# Altium project Main.PrjPCB
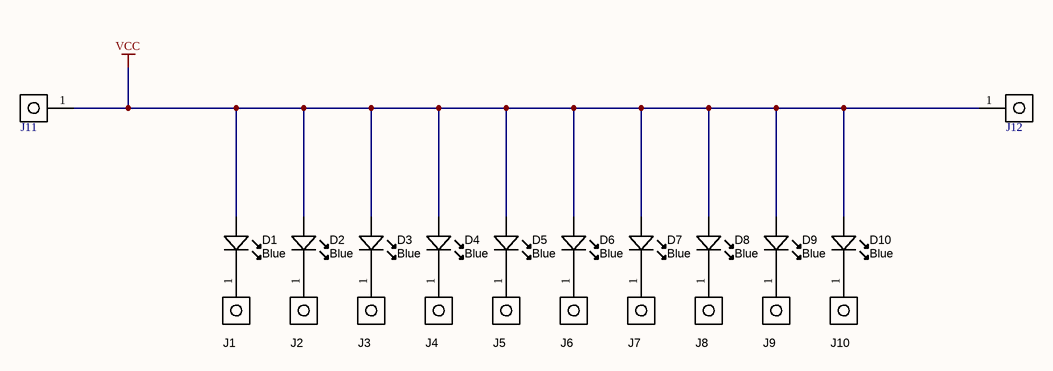
[diagram p0: LEDs.SchDoc]
1 sheet, 22 parts. Net scope: global (net labels, ports and power ports of the same name join across sheets).
Board file: PCB.PcbDoc

## Sheet LEDs.SchDoc
size A4

### Parts
D1  Blue  [LED-0805S-SIDELED-2.1X0.6X1.0]
D2  Blue  [LED-0805S-SIDELED-2.1X0.6X1.0]
D3  Blue  [LED-0805S-SIDELED-2.1X0.6X1.0]
D4  Blue  [LED-0805S-SIDELED-2.1X0.6X1.0]
D5  Blue  [LED-0805S-SIDELED-2.1X0.6X1.0]
D6  Blue  [LED-0805S-SIDELED-2.1X0.6X1.0]
D7  Blue  [LED-0805S-SIDELED-2.1X0.6X1.0]
D8  Blue  [LED-0805S-SIDELED-2.1X0.6X1.0]
D9  Blue  [LED-0805S-SIDELED-2.1X0.6X1.0]
D10  Blue  [LED-0805S-SIDELED-2.1X0.6X1.0]
J1  CONN_SOCKET_1x1P_0.100in  [1x1POS_SOCKET_LOWPROF]  (value not drawn)
J2  CONN_SOCKET_1x1P_0.100in  [1x1POS_SOCKET_LOWPROF]  (value not drawn)
J3  CONN_SOCKET_1x1P_0.100in  [1x1POS_SOCKET_LOWPROF]  (value not drawn)
J4  CONN_SOCKET_1x1P_0.100in  [1x1POS_SOCKET_LOWPROF]  (value not drawn)
J5  CONN_SOCKET_1x1P_0.100in  [1x1POS_SOCKET_LOWPROF]  (value not drawn)
J6  CONN_SOCKET_1x1P_0.100in  [1x1POS_SOCKET_LOWPROF]  (value not drawn)
J7  CONN_SOCKET_1x1P_0.100in  [1x1POS_SOCKET_LOWPROF]  (value not drawn)
J8  CONN_SOCKET_1x1P_0.100in  [1x1POS_SOCKET_LOWPROF]  (value not drawn)
J9  CONN_SOCKET_1x1P_0.100in  [1x1POS_SOCKET_LOWPROF]  (value not drawn)
J10  CONN_SOCKET_1x1P_0.100in  [1x1POS_SOCKET_LOWPROF]  (value not drawn)
J11  CONN_SOCKET_1x1P_0.100in  [1x1POS_SOCKET_LOWPROF]  (value not drawn)
J12  CONN_SOCKET_1x1P_0.100in  [1x1POS_SOCKET_LOWPROF]  (value not drawn)

### Nets
VCC: D1.A D2.A D3.A D4.A D5.A D6.A D7.A D8.A D9.A D10.A J11.1 J12.1
NetD1_K: D1.K J1.1
NetD2_K: D2.K J2.1
NetD3_K: D3.K J3.1
NetD4_K: D4.K J4.1
NetD5_K: D5.K J5.1
NetD6_K: D6.K J6.1
NetD7_K: D7.K J7.1
NetD8_K: D8.K J8.1
NetD9_K: D9.K J9.1
NetD10_K: D10.K J10.1

### Library data of the parts
D1-D10 = LED_SMD_PureGreen_0805RA_250mcd: LED 0805 SIDELED SMD Green 250mcd 525nm; Manufacturer 1: Kingbright Corp; Manufacturer Part Number 1: APA2106ZGC; Material: InGaN; Ratings: 250 mcd; 525 nm; SCDType: source; Package / Case: 2.1x0.6x1.0mm SIDELED; Value: Blue; Supplier 1: Digi-Key; Supplier Part Number 1: 754-1062-1-ND; Color: Blue
J1-J12 = CONN_SOCKET_1x1P_0.100in: Socket header THT 1-Pos Low profile Single-row 2.54mm pitch; Manufacturer 1: Mill-Max Manufacturing Corp.; Manufacturer Part Number 1: 801-93-064-10-002000; Pitch: 0.100" (2.54mm); Value: 1x1 Pos.; QtyOverride: 0.02; SCDType: undef; Category: Connectors; Mounting Type: Through Hole; Package / Case: Socket header; 2.54mm pitch; Supplier 1: Digi-Key; Supplier Part Number 1: ED2764-ND